# Altium project LimeSDR-Mini_2v1.PrjPcb (part 2 of 5)

## Sheet 07_LMS7002M_Power.SchDoc: LMS7002M power
size A3; Organization: Lime Microsystems; Address1: Surrey Tech Centre; Address2: Guildford GU2 7YG; Address3: Surrey; Address4: United Kingdom; Revision: v2.1; SheetNumber: 7; SheetTotal: 10
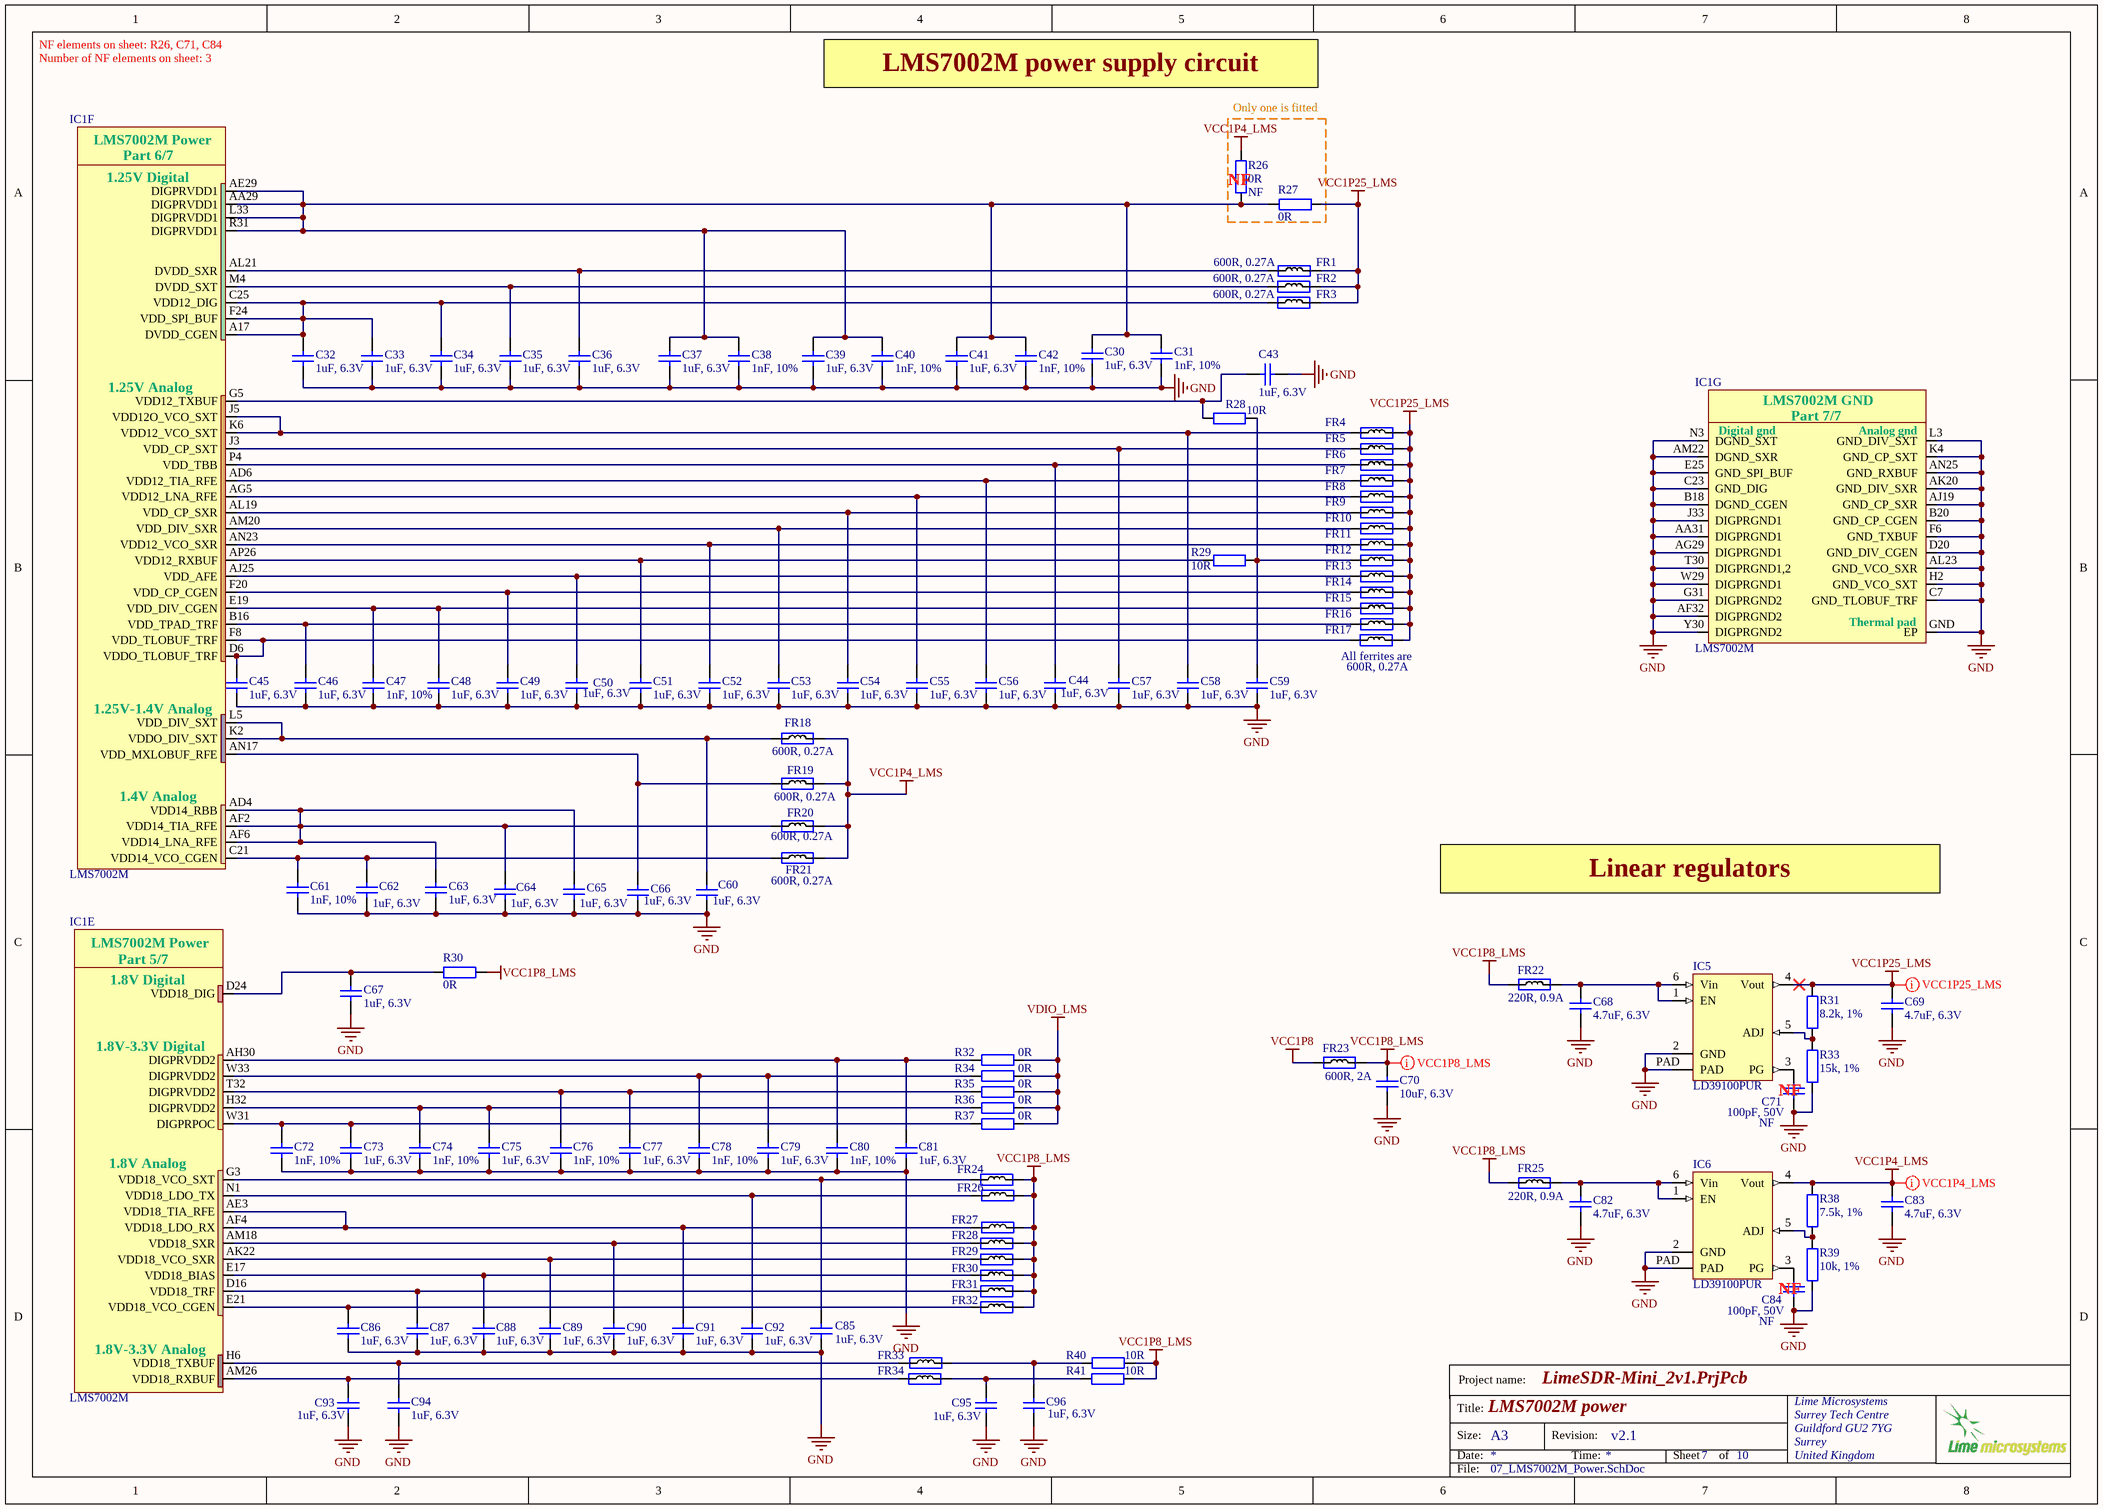
[diagram p6: 07_LMS7002M_Power.SchDoc]

### Parts
C30  1uF, 6.3V  [CAP0201]
C31  1nF, 10%  [CAP0201]
C32  1uF, 6.3V  [CAP0201]
C33  1uF, 6.3V  [CAP0201]
C34  1uF, 6.3V  [CAP0201]
C35  1uF, 6.3V  [CAP0201]
C36  1uF, 6.3V  [CAP0201]
C37  1uF, 6.3V  [CAP0201]
C38  1nF, 10%  [CAP0201]
C39  1uF, 6.3V  [CAP0201]
C40  1nF, 10%  [CAP0201]
C41  1uF, 6.3V  [CAP0201]
C42  1nF, 10%  [CAP0201]
C43  1uF, 6.3V  [CAP0201]
C44  1uF, 6.3V  [CAP0201]
C45  1uF, 6.3V  [CAP0201]
C46  1uF, 6.3V  [CAP0201]
C47  1nF, 10%  [CAP0201]
C48  1uF, 6.3V  [CAP0201]
C49  1uF, 6.3V  [CAP0201]
C50  1uF, 6.3V  [CAP0201]
C51  1uF, 6.3V  [CAP0201]
C52  1uF, 6.3V  [CAP0201]
C53  1uF, 6.3V  [CAP0201]
C54  1uF, 6.3V  [CAP0201]
C55  1uF, 6.3V  [CAP0201]
C56  1uF, 6.3V  [CAP0201]
C57  1uF, 6.3V  [CAP0201]
C58  1uF, 6.3V  [CAP0201]
C59  1uF, 6.3V  [CAP0201]
C60  1uF, 6.3V  [CAP0201]
C61  1nF, 10%  [CAP0201]
C62  1uF, 6.3V  [CAP0201]
C63  1uF, 6.3V  [CAP0201]
C64  1uF, 6.3V  [CAP0201]
C65  1uF, 6.3V  [CAP0201]
C66  1uF, 6.3V  [CAP0201]
C67  1uF, 6.3V  [CAP0201]
C68  4.7uF, 6.3V  [CAP0402]
C69  4.7uF, 6.3V  [CAP0402]
C70  10uF, 6.3V  [CAP0603]
C71  100pF, 50V  Assembly Info: NF  [CAP0402]
C72  1nF, 10%  [CAP0201]
C73  1uF, 6.3V  [CAP0201]
C74  1nF, 10%  [CAP0201]
C75  1uF, 6.3V  [CAP0201]
C76  1nF, 10%  [CAP0201]
C77  1uF, 6.3V  [CAP0201]
C78  1nF, 10%  [CAP0201]
C79  1uF, 6.3V  [CAP0201]
C80  1nF, 10%  [CAP0201]
C81  1uF, 6.3V  [CAP0201]
C82  4.7uF, 6.3V  [CAP0402]
C83  4.7uF, 6.3V  [CAP0402]
C84  100pF, 50V  Assembly Info: NF  [CAP0402]
C85  1uF, 6.3V  [CAP0201]
C86  1uF, 6.3V  [CAP0201]
C87  1uF, 6.3V  [CAP0201]
C88  1uF, 6.3V  [CAP0201]
C89  1uF, 6.3V  [CAP0201]
C90  1uF, 6.3V  [CAP0201]
C91  1uF, 6.3V  [CAP0201]
C92  1uF, 6.3V  [CAP0201]
C93  1uF, 6.3V  [CAP0201]
C94  1uF, 6.3V  [CAP0201]
C95  1uF, 6.3V  [CAP0201]
C96  1uF, 6.3V  [CAP0201]
FR1  600R, 0.27A  [RES0201]
FR2  600R, 0.27A  [RES0201]
FR3  600R, 0.27A  [RES0201]
FR4  600R, 0.27A  [RES0201]
FR5  600R, 0.27A  [RES0201]  (value not drawn)
FR6  600R, 0.27A  [RES0201]  (value not drawn)
FR7  600R, 0.27A  [RES0201]  (value not drawn)
FR8  600R, 0.27A  [RES0201]  (value not drawn)
FR9  600R, 0.27A  [RES0201]  (value not drawn)
FR10  600R, 0.27A  [RES0201]  (value not drawn)
FR11  600R, 0.27A  [RES0201]  (value not drawn)
FR12  600R, 0.27A  [RES0201]  (value not drawn)
FR13  600R, 0.27A  [RES0201]  (value not drawn)
FR14  600R, 0.27A  [RES0201]  (value not drawn)
FR15  600R, 0.27A  [RES0201]  (value not drawn)
FR16  600R, 0.27A  [RES0201]  (value not drawn)
FR17  600R, 0.27A  [RES0201]  (value not drawn)
FR18  600R, 0.27A  [RES0201]
FR19  600R, 0.27A  [RES0201]
FR20  600R, 0.27A  [RES0201]
FR21  600R, 0.27A  [RES0201]
FR22  220R, 0.9A  [RES0402]
FR23  600R, 2A  [RES0805]
FR24  600R, 0.27A  [RES0201]  (value not drawn)
FR25  220R, 0.9A  [RES0402]
FR26  600R, 0.27A  [RES0201]  (value not drawn)
FR27  600R, 0.27A  [RES0201]  (value not drawn)
FR28  600R, 0.27A  [RES0201]  (value not drawn)
FR29  600R, 0.27A  [RES0201]  (value not drawn)
FR30  600R, 0.27A  [RES0201]  (value not drawn)
FR31  600R, 0.27A  [RES0201]  (value not drawn)
FR32  600R, 0.27A  [RES0201]  (value not drawn)
FR33  600R, 0.27A  [RES0201]  (value not drawn)
FR34  600R, 0.27A  [RES0201]  (value not drawn)
IC1  LMS7002M  [LMS7002M_v5]  (parts E,F,G of 7)
IC5  LD39100PUR  [LD39100PUR]
IC6  LD39100PUR  [LD39100PUR]
R26  0R  Assembly Info: NF  [RES0402]
R27  0R  [RES0402]
R28  10R  [RES0201]
R29  10R  [RES0201]
R30  0R  [RES0201]
R31  8.2k, 1%  [RES0402]
R32  0R  [RES0402]
R33  15k, 1%  [RES0402]
R34  0R  [RES0402]
R35  0R  [RES0402]
R36  0R  [RES0402]
R37  0R  [RES0402]
R38  7.5k, 1%  [RES0402]
R39  10k, 1%  [RES0402]
R40  10R  [RES0201]
R41  10R  [RES0201]

### Blocks framed on the sheet
Only one is fitted: R26 R27

### Nets
GND: C30.2 C31.2 C32.2 C33.2 C34.2 C35.1 C36.2 C37.2 C38.2 C39.2 C40.2 C41.2 C42.2 C43.2 C44.2 C45.2 C46.2 C47.2 C48.2 C49.1 C50.2 C51.2 C52.2 C53.2 C54.2 C55.2 C56.1 C57.2 C58.1 C59.1 C60.2 C61.2 C62.2 C63.2 C64.2 C65.2 C66.2 C67.2 C68.1 C69.1 C70.1 C71.1 C72.2 C73.2 C74.2 C75.2 C76.2 C77.2 C78.2 C79.2 C80.2 C81.2 C82.1 C83.1 C84.1 C85.2 C86.2 C87.2 C88.2 C89.2 C90.2 C91.2 C92.2 C93.2 C94.2 C95.2 C96.2 IC1.AA31(DIGPRGND1) IC1.AF32(DIGPRGND2) IC1.AG29(DIGPRGND1) IC1.AJ19(GND_CP_SXR) IC1.AK20(GND_DIV_SXR) IC1.AL23(GND_VCO_SXR) IC1.AM22(DGND_SXR) IC1.AN25(GND_RXBUF) IC1.B18(DGND_CGEN) IC1.B20(GND_CP_CGEN) IC1.C7(GND_TLOBUF_TRF) IC1.C23(GND_DIG) IC1.D20(GND_DIV_CGEN) IC1.E25(GND_SPI_BUF) IC1.F6(GND_TXBUF) IC1.G31(DIGPRGND2) IC1.GND(EP) IC1.H2(GND_VCO_SXT) IC1.J33(DIGPRGND1) IC1.K4(GND_CP_SXT) IC1.L3(GND_DIV_SXT) IC1.N3(DGND_SXT) IC1.T30(DIGPRGND1,2) IC1.W29(DIGPRGND1) IC1.Y30(DIGPRGND2) IC5.2(GND) IC5.PAD IC6.2(GND) IC6.PAD R33.1 R39.1
VCC1P4_LMS: C83.2 FR18.2 FR19.2 FR20.2 FR21.2 IC6.4(Vout) R26.1 R38.2
VCC1P8: FR23.1
VCC1P8_LMS: C70.2 FR22.1 FR23.2 FR24.2 FR25.1 FR26.1 FR27.1 FR28.2 FR29.2 FR30.2 FR31.2 FR32.2 R30.2 R40.2 R41.1
VCC1P25_LMS: C69.2 FR1.2 FR2.2 FR3.2 FR4.2 FR5.2 FR6.2 FR7.2 FR8.2 FR9.2 FR10.2 FR11.2 FR12.2 FR13.2 FR14.2 FR15.2 FR16.2 FR17.2 IC5.4(Vout) R27.1 R31.2
VDIO_LMS: R32.1 R34.1 R35.1 R36.1 R37.1
NetC30_1: C30.1 C31.1 C37.1 C38.1 C39.1 C40.1 C41.1 C42.1 IC1.AA29(DIGPRVDD1) IC1.AE29(DIGPRVDD1) IC1.L33(DIGPRVDD1) IC1.R31(DIGPRVDD1) R26.2 R27.2
NetC32_1: C32.1 C33.1 C34.1 FR3.1 IC1.A17(DVDD_CGEN) IC1.C25(VDD12_DIG) IC1.F24(VDD_SPI_BUF)
NetC35_2: C35.2 FR2.1 IC1.M4(DVDD_SXT)
NetC36_1: C36.1 FR1.1 IC1.AL21(DVDD_SXR)
NetC43_1: C43.1 IC1.G5(VDD12_TXBUF) R28.1
NetC44_1: C44.1 FR6.1 IC1.P4(VDD_TBB)
NetC45_1: C45.1 FR17.1 IC1.D6(VDDO_TLOBUF_TRF) IC1.F8(VDD_TLOBUF_TRF)
NetC46_1: C46.1 FR16.1 IC1.B16(VDD_TPAD_TRF)
NetC47_1: C47.1 C48.1 FR15.1 IC1.E19(VDD_DIV_CGEN)
NetC49_2: C49.2 FR14.1 IC1.F20(VDD_CP_CGEN)
NetC50_1: C50.1 FR13.1 IC1.AJ25(VDD_AFE)
NetC51_1: C51.1 IC1.AP26(VDD12_RXBUF) R29.1
NetC52_1: C52.1 FR11.1 IC1.AN23(VDD12_VCO_SXR)
NetC53_1: C53.1 FR10.1 IC1.AM20(VDD_DIV_SXR)
NetC54_1: C54.1 FR9.1 IC1.AL19(VDD_CP_SXR)
NetC55_1: C55.1 FR8.1 IC1.AG5(VDD12_LNA_RFE)
NetC56_2: C56.2 FR7.1 IC1.AD6(VDD12_TIA_RFE)
NetC57_1: C57.1 FR5.1 IC1.J3(VDD_CP_SXT)
NetC58_2: C58.2 FR4.1 IC1.J5(VDD12O_VCO_SXT) IC1.K6(VDD12_VCO_SXT)
NetC59_2: C59.2 FR12.1 R28.2 R29.2
NetC60_1: C60.1 FR18.1 IC1.K2(VDDO_DIV_SXT) IC1.L5(VDD_DIV_SXT)
NetC61_1: C61.1 C62.1 FR21.1 IC1.C21(VDD14_VCO_CGEN)
NetC63_1: C63.1 C64.1 C65.1 FR20.1 IC1.AD4(VDD14_RBB) IC1.AF2(VDD14_TIA_RFE) IC1.AF6(VDD14_LNA_RFE)
NetC66_1: C66.1 FR19.1 IC1.AN17(VDD_MXLOBUF_RFE)
NetC67_1: C67.1 IC1.D24(VDD18_DIG) R30.1
NetC68_2: C68.2 FR22.2 IC5.1(EN) IC5.6(Vin)
NetC71_2: C71.2 IC5.3(PG)
NetC72_1: C72.1 C73.1 IC1.W31(DIGPRPOC) R37.2
NetC74_1: C74.1 C75.1 IC1.H32(DIGPRVDD2) R36.2
NetC76_1: C76.1 C77.1 IC1.T32(DIGPRVDD2) R35.2
NetC78_1: C78.1 C79.1 IC1.W33(DIGPRVDD2) R34.2
NetC80_1: C80.1 C81.1 IC1.AH30(DIGPRVDD2) R32.2
NetC82_2: C82.2 FR25.2 IC6.1(EN) IC6.6(Vin)
NetC84_2: C84.2 IC6.3(PG)
NetC85_1: C85.1 FR24.1 IC1.G3(VDD18_VCO_SXT)
NetC86_1: C86.1 FR32.1 IC1.E21(VDD18_VCO_CGEN)
NetC87_1: C87.1 FR31.1 IC1.D16(VDD18_TRF)
NetC88_1: C88.1 FR30.1 IC1.E17(VDD18_BIAS)
NetC89_1: C89.1 FR29.1 IC1.AK22(VDD18_VCO_SXR)
NetC90_1: C90.1 FR28.1 IC1.AM18(VDD18_SXR)
NetC91_1: C91.1 FR27.2 IC1.AE3(VDD18_TIA_RFE) IC1.AF4(VDD18_LDO_RX)
NetC92_1: C92.1 FR26.2 IC1.N1(VDD18_LDO_TX)
NetC93_1: C93.1 FR34.1 IC1.AM26(VDD18_RXBUF)
NetC94_1: C94.1 FR33.2 IC1.H6(VDD18_TXBUF)
NetC95_1: C95.1 FR34.2 R41.2
NetC96_1: C96.1 FR33.1 R40.1
NetIC5_5: IC5.5(ADJ) R31.1 R33.2
NetIC6_5: IC6.5(ADJ) R38.1 R39.2

### Layout directives
net class VCC1P25_LMS: VCC1P25_LMS
net class VCC1P4_LMS: VCC1P4_LMS
net class VCC1P8_LMS: VCC1P8_LMS

### Notes on the sheet
- NF elements on sheet: R26, C71, C84
- Number of NF elements on sheet: 3
- LMS7002M power supply circuit
- (near R26) NF
- (near FR17) All ferrites are
- Linear regulators
- NF
- Project name:
- Title:
- Size:
- Date:
- A3
- Revision:
- Time:
- Sheet
- of
- File:
- (in symbol LMS7002Mr4, part E) LMS7002M Power; Part 5/7; 1.8V Digital; 1.8V-3.3V Digital; 1.8V Analog; 1.8V-3.3V Analog
- (in symbol LMS7002Mr4, part F) LMS7002M Power; Part 6/7; 1.25V Digital; 1.25V Analog; 1.25V-1.4V Analog; 1.4V Analog
- (in symbol LMS7002Mr4, part G) LMS7002M GND; Part 7/7; Digital gnd; Analog gnd; Thermal pad

### Library data of the parts
C30 C32-C37 C39 C41 C43-C46 C48-C60 C62-C67 C73 C75 C77 C79 C81 C85-C96 = Cap_0402: Manufacturer: TDK Corporation; Manufacturer Part Number 1: JMK063ABJ105MP-F; Part Description: 1µF ±20% 6.3V X5R Ceramic Capacitor -55°C ~ 85°C Surface Mount, MLCC 0201 (0603 Metric) 0.024" L x 0.012" W (0.60mm x 0.30mm); Value: 1uF, 20%; Tolerance: ±20%; Capacitance: 1.0µF; Temperature Coefficient: X5R; Supplier 1: Digi-Key; Supplier Part Number 1: 587-5864-2-ND; Applications: General Purpose; Features: -; Lead Style: -; Ratings: -; Thickness (Max): -; Lead Spacing: -; Height - Seated (Max): -; Size / Dimension: 0.024" L x 0.012" W (0.60mm x 0.30mm); Mounting Type: Surface Mount, MLCC; Operating Temperature: -55°C ~ 85°C; Package / Case: 0201 (0603 Metric); Packaging: Cut Tape (CT); Voltage - Rated: 6.3V; Category: Capacitors; RoHS: RoHS Compliant
C31 C38 C40 C42 C47 C61 C72 C74 C76 C78 C80 = Cap_0402: Manufacturer Part Number 1: C0603X7R1E102K030BA; Manufacturer: TDK Corporation; Part Description: 1000pF ±10% 25V X7R Ceramic Capacitor -55°C ~ 125°C Surface Mount, MLCC 0201 (0603 Metric) 0.024" L x 0.012" W (0.60mm x 0.30mm); Voltage - Rated: 25V; Temperature Coefficient: X7R; Capacitance: 1000pF; Value: 1nF, 10%; Supplier 1: Digi-Key; Supplier Part Number 1: 445-7275-1-ND; Features: -; Package / Case: 0201 (0603 Metric); Lead Spacing: -; Mounting Type: Surface Mount, MLCC; Lead Style: -; Height - Seated (Max): -; Operating Temperature: -55°C ~ 125°C; Tolerance: ±10%; Size / Dimension: 0.024" L x 0.012" W (0.60mm x 0.30mm); Applications: General Purpose; Ratings: -; Thickness (Max): 0.013" (0.33mm); RoHS: RoHS Compliant; Packaging: Cut Tape (CT); Category: Capacitors
C68 C69 C82 C83 = Cap_0402: Manufacturer: Murata Electronics North America; Manufacturer Part Number 1: GRM155R60J475ME87D; Part Description: 4.7µF ±20% 6.3V X5R Ceramic Capacitor -55°C ~ 85°C Surface Mount, MLCC 0402 (1005 Metric) 0.039" L x 0.020" W (1.00mm x 0.50mm); Tolerance: ±20%; Capacitance: 4.7µF; Temperature Coefficient: X5R; Lead Style: -; Ratings: -; Height - Seated (Max): -; Thickness (Max): 0.022" (0.55mm); Voltage - Rated: 6.3V; Packaging: Cut Tape (CT); Lead Spacing: -; Category: Capacitors; Supplier Part Number 1: 490-5408-1-ND; Applications: General Purpose; Operating Temperature: -55°C ~ 85°C; Mounting Type: Surface Mount, MLCC; Features: Derating Recommended; RoHS: RoHS Compliant; Supplier 1: Digi-Key; Package / Case: 0402 (1005 Metric); Size / Dimension: 0.039" L x 0.020" W (1.00mm x 0.50mm); Value: 4.7uF, 6.3V
C70 = Cap_0603: Manufacturer Part Number 1: CC0603MRX5R5BB106; Manufacturer: Yageo; Part Description: 10µF ±20% 6.3V X5R Ceramic Capacitor -55°C ~ 85°C Surface Mount, MLCC 0603 (1608 Metric) 0.063" L x 0.031" W (1.60mm x 0.80mm); Capacitance: 10µF; Tolerance: ±20%; Supplier 1: Digi-Key; Supplier Part Number 1: 311-1448-2-ND; Package / Case: 0603 (1608 Metric); Category: Capacitors; Voltage - Rated: 6.3V; Value: 10uF, 6.3V
C71 C84 = Cap_0402: Manufacturer Part Number 1: CC0402JRNPO9BN101; Manufacturer: Yageo; Part Description: 100pF ±5% 50V C0G, NP0 Ceramic Capacitor -55°C ~ 125°C Surface Mount, MLCC 0402 (1005 Metric) 0.039" L x 0.020" W (1.00mm x 0.50mm); Temperature Coefficient: C0G, NP0; Tolerance: ±5%; Value: 100pF, 50V; Supplier 1: Digi-Key; Supplier Part Number 1: 311-1024-1-ND; RoHS: RoHS Compliant; Category: Capacitors; Applications: General Purpose; Mounting Type: Surface Mount, MLCC; Capacitance: 100pF; Ratings: -; Packaging: Cut Tape (CT); Voltage - Rated: 50V; Size / Dimension: 0.039" L x 0.020" W (1.00mm x 0.50mm); Height - Seated (Max): -; Package / Case: 0402 (1005 Metric); Operating Temperature: -55°C ~ 125°C; Features: -; Lead Spacing: -; Lead Style: -; Thickness (Max): 0.022" (0.55mm)
FR1-FR21 FR24 FR26-FR34 = Ferrite: Manufacturer Part Number 1: BK0603TS601-T; Manufacturer: Taiyo Yuden; Part Description: FERRITE BEAD 600 OHM 0201 1LN; DC Resistance (DCR): 750 mOhm Max; Filter Type: Differential Mode - Single; Impedance @ Frequency: 600 Ohm @ 100MHz; Current Rating: 270mA; Value: 600R@100MHz; Supplier 1: Digi-Key; Supplier Part Number 1: 587-3277-1-ND; Size / Dimension: 0.024" L x 0.012" W (0.60mm x 0.30mm); Package / Case: 0201 (0603 Metric); Height (Max): 0.013" (0.33mm); Mounting Type: Surface Mount; Packaging: Cut Tape (CT); RoHS: RoHS Compliant; Category: Filters
FR22 FR25 = Ferrite: Manufacturer: TDK Corporation; Manufacturer Part Number 1: MPZ1005S221ET000; Part Description: FERRITE BEAD 220 OHM 0402 1LN; Impedance @ Frequency: 220 Ohm @ 100MHz; Current Rating: 900mA; DC Resistance (DCR): 220 mOhm Max; Supplier 1: Digi-Key; Package / Case: 0402 (1005 Metric); Category: Filters; Supplier Part Number 1: 445-9329-2-ND; Value: 220R, 0.9A
FR23 = Ferrite: Manufacturer Part Number 1: MPZ2012S601AT000; Manufacturer: TDK Corporation; Part Description: FERRITE BEAD 600 OHM 0805 1LN; Filter Type: Differential Mode - Single; Impedance @ Frequency: 600 Ohm @ 100MHz; DC Resistance (DCR): 100 mOhm Max; Supplier 1: Digi-Key; Supplier Part Number 1: 445-2206-2-ND; Mounting Type: Surface Mount; RoHS: RoHS Compliant; Height (Max): 0.041" (1.05mm); Packaging: Tape & Reel (TR); Category: Filters; Current Rating: 2A; Package / Case: 0805 (2012 Metric); Size / Dimension: 0.079" L x 0.049" W (2.00mm x 1.25mm)
IC1 = LMS7002Mr4: as IC1 on sheet 05_LMS7002M_Misc; Supplier 1: Lime Microsystems; Supplier Part Number 1: LMS7002M; Manufacturer Part Number 1: LMS7002M
IC5 IC6 = LD39100PUR: Manufacturer: STMicroelectronics; Part Description: Linear Voltage Regulator IC Positive Adjustable Output 0.8 V ~ 4.5 V 1A 6-DFN (3x3); Output Configuration: Positive; Output Type: Adjustable; Voltage - Input (Max): 5.5V; Voltage - Output (Min/Fixed): 0.8V; Voltage - Output (Max): 4.6V; Voltage Dropout (Max): 0.4V @ 1A; Current - Output: 1A; Current - Supply: 50µA ~ 300µA; PSRR: 70dB ~ 65dB (1kHz ~ 10kHz); Control Features: Enable, Power Good; Protection Features: Over Current, Over Temperature, Short Circuit; Supplier 1: Digi-Key; Manufacturer Part Number 1: LD39100PUR; RoHS: RoHS Compliant; Category: Integrated Circuits (ICs); Stock 1: 27970; Pricing 1: 1=0.85, 10=0.76, 100=0.5923, 500=0.48926, 1000=0.38625 (USD); Packaging: Cut Tape (CT); Part Status: Active; Operating Temperature: -40°C ~ 125°C; Mounting Type: Surface Mount; Package / Case: 6-VDFN Exposed Pad; Supplier Device Package: 6-DFN (3x3); ComponentLink1URL: http://www.st.com/content/ccc/resource/technical/document/datasheet/72/02/e5/ee/df/36/40/5e/CD00233788.pdf/files/CD00233788.pdf/jcr:content/translations/en.CD00233788.pdf; ComponentLink1Description: http://www.st.com/content/ccc/resource/technical/document/datasheet/72/02/e5/ee/df/36/40/5e/CD00233788.pdf/files/CD00233788.pdf/jcr:content/translations/en.CD00233788.pdf; Supplier Part Number 1: 497-11013-1-ND
R26 R27 R32 R34-R37 = Res_0402: Manufacturer Part Number 1: RC0402JR-070RL; Manufacturer: Yageo; Part Description: RES SMD 0.0OHM JUMPER 1/16W 0402; Resistance (Ohms): 0.0; Tolerance: Jumper; Power (Watts): 0.063W, 1/16W; Value: 0R; Supplier 1: Digi-Key; Supplier Part Number 1: 311-0.0JRTR-ND; Category: Resistors; Temperature Coefficient: -; Features: Moisture Resistant; Supplier Device Package: 0402; Height: 0.016" (0.40mm); Package / Case: 0402 (1005 Metric); Operating Temperature: -55°C ~ 155°C; Size / Dimension: 0.039" L x 0.020" W (1.00mm x 0.50mm); Composition: Thick Film; Packaging: Tape & Reel (TR); Number of Terminations: 2; RoHS: RoHS Compliant
R28 R29 R40 R41 = Res_0402: Manufacturer: Panasonic Electronic Components; Part Description: RES SMD 10 OHM 1% 1/20W 0201; Manufacturer Part Number 1: ERJ-1GEF10R0C; Power (Watts): 0.05W, 1/20W; Resistance (Ohms): 10; Tolerance: ±1%; Temperature Coefficient: ±200ppm/°C; Value: 10R; Supplier 1: Digi-Key; Supplier Part Number 1: P10.0ABCT-ND; Package / Case: 0201 (0603 Metric); Height: 0.010" (0.26mm); Supplier Device Package: 0201; Packaging: Cut Tape (CT); Composition: Thick Film; Category: Resistors; Number of Terminations: 2; Size / Dimension: 0.024" L x 0.012" W (0.60mm x 0.30mm); Operating Temperature: -55°C ~ 125°C; Features: -; RoHS: RoHS Compliant
R30 = Res_0402: Manufacturer Part Number 1: RC0201FR-070RL; Manufacturer: Rohm Semiconductor; Part Description: RES SMD 0.0OHM JUMPER 1/20W 0201; Resistance (Ohms): 0.0; Power (Watts): 0.063W, 1/16W; Tolerance: Jumper; Value: 0R; Supplier 1: Digi-Key; Supplier Part Number 1: 311-0.0MCT-ND; Number of Terminations: 2; Operating Temperature: -55°C ~ 155°C; Package / Case: 0201 (0603 Metric); Height: 0.016" (0.40mm); Supplier Device Package: 0402; Size / Dimension: 0.039" L x 0.020" W (1.00mm x 0.50mm); Temperature Coefficient: -; Category: Resistors; Features: Moisture Resistant; RoHS: RoHS Compliant; Composition: Thick Film; Packaging: Tape & Reel (TR)
R31 = Res_0402: Manufacturer: Yageo; Part Description: RES SMD 8.2K OHM 1% 1/16W 0402; Manufacturer Part Number 1: RC0402FR-078K2L; Power (Watts): 0.063W, 1/16W; Temperature Coefficient: ±100ppm/°C; Value: 8.2k, 1%; Supplier 1: Digi-Key; Supplier Device Package: 0402; Package / Case: 0402 (1005 Metric); Height: 0.016" (0.40mm); Supplier Part Number 1: 311-8.20KLRCT-ND; Number of Terminations: 2; Operating Temperature: -55°C ~ 155°C; Resistance (Ohms): 8.2k; Size / Dimension: 0.039" L x 0.020" W (1.00mm x 0.50mm); Composition: Thick Film; Category: Resistors; Tolerance: ±1%; Features: Moisture Resistant; RoHS: RoHS Compliant; Packaging: Cut Tape (CT)
R33 = Res_0402: Manufacturer: Yageo; Manufacturer Part Number 1: RC0402FR-0715KL; Part Description: RES SMD 15K OHM 1% 1/16W 0402; Temperature Coefficient: ±100ppm/°C; Power (Watts): 0.063W, 1/16W; Value: 15k, 1%; Category: Resistors; Number of Terminations: 2; RoHS: RoHS Compliant; Features: Moisture Resistant; Operating Temperature: -55°C ~ 155°C; Tolerance: ±1%; Composition: Thick Film; Resistance (Ohms): 15k; Failure Rate: -; Height - Seated (Max): 0.016" (0.40mm); Packaging: Cut Tape (CT); Supplier Device Package: 0402; Size / Dimension: 0.039" L x 0.020" W (1.00mm x 0.50mm); Package / Case: 0402 (1005 Metric); Part Status: Active; Supplier 1: Digi-Key; Supplier Part Number 1: 311-15.0KLRCT-ND
R38 = Res_0402: Manufacturer: Yageo; Manufacturer Part Number 1: RC0402FR-077K5L; Part Description: ±1% 0.063W, 1/16W Chip Resistor 0402 (1005 Metric) Automotive AEC-Q200, Moisture Resistant Thick Film; Power (Watts): 0.063W, 1/16W; Temperature Coefficient: ±100ppm/°C; Value: 7.5k, 1%; Operating Temperature: -55°C ~ 155°C; Height - Seated (Max): 0.016" (0.40mm); Supplier 1: Digi-Key; Composition: Thick Film; Packaging: Cut Tape (CT); Tolerance: ±1%; Category: Resistors; Part Status: Active; Failure Rate: -; Supplier Device Package: 0402; Features: Moisture Resistant; Supplier Part Number 1: YAG3512CT-ND; RoHS: RoHS Compliant; Package / Case: 0402 (1005 Metric); Size / Dimension: 0.039" L x 0.020" W (1.00mm x 0.50mm)
R39 = Res_0402: as R3 on sheet 05_LMS7002M_Misc; Value: 10k, 1%; Supplier 1: Digi-Key; Supplier Part Number 1: 311-10.0KLRTR-ND; Resistance (Ohms): 10k; Packaging: Tape & Reel (TR); RoHS: RoHS Compliant; Package / Case: 0402 (1005 Metric); Tolerance: ±1%; Operating Temperature: -55°C ~ 155°C; Size / Dimension: 0.039" L x 0.020" W (1.00mm x 0.50mm); Number of Terminations: 2; Category: Resistors; Height: 0.016" (0.40mm); Supplier Device Package: 0402; Features: Moisture Resistant; Composition: Thick Film